# Altium schematic sheet ADF_2nd_LO_board.SchDoc
size A4
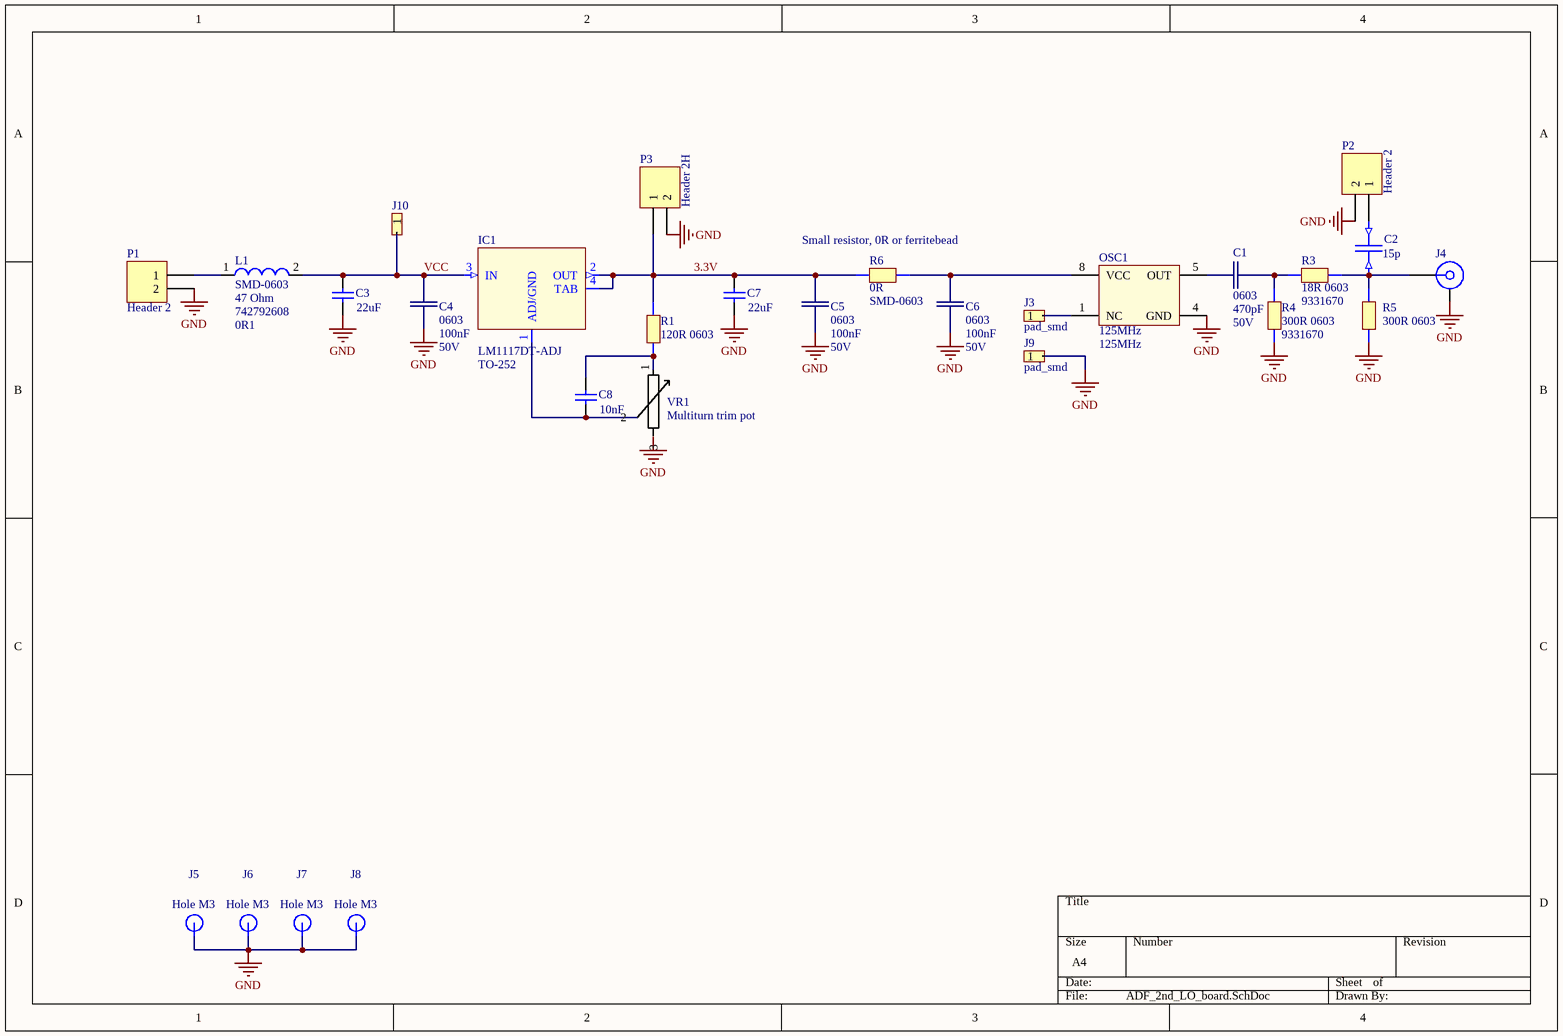
[diagram p0: ADF_2nd_LO_board.SchDoc]

## Parts
C1  Case Code (Imperial): 0603  Capacitance: 470pF  Voltage: 50V  [C0603_murata]  (hidden comment: 10nF 0603 NP0)
C2  value 15p  [CAPC1005X04N_0402]  (hidden comment: Capacitor)
C3  value 22uF  [C1206]  (hidden comment: Cap Semi)
C4  Case Code (Imperial): 0603  Capacitance: 100nF  Voltage: 50V  [C0603_murata]  (hidden comment: 10nF 0603 NP0)
C5  Case Code (Imperial): 0603  Capacitance: 100nF  Voltage: 50V  [C0603_murata]  (hidden comment: 10nF 0603 NP0)
C6  Case Code (Imperial): 0603  Capacitance: 100nF  Voltage: 50V  [C0603_murata]  (hidden comment: 10nF 0603 NP0)
C7  value 22uF  [C1206]  (hidden comment: Cap Semi)
C8  value 10nF  [1608[0603]]  (hidden comment: Cap Semi)
IC1  value LM1117DT-ADJ  [TO-252]  (hidden comment: Voltage Regulator)
J3  pad_smd  [pad_smd_bodge]
J4  32K201-400L5  [ROS-32K201-400L5_V]  (value not drawn)
J5  Hole M3  [HOLE_M3]  (no BOM)
J6  Hole M3  [HOLE_M3]  (no BOM)
J7  Hole M3  [HOLE_M3]  (no BOM)
J8  Hole M3  [HOLE_M3]  (no BOM)
J9  pad_smd  [pad_smd_bodge]
J10  pad_smd  [pad_smd_bodge]  (value not drawn)
L1  Impedance: 47 Ohm  DC_Resistance: 0R1  [SMD-0603]  (hidden comment: 742792608)
OSC1  125MHz  [DIP-8_osc]
P1  Header 2  [HDR1X2]
P2  Header 2  [HDR1X2]
P3  Header 2H  [HDR1X2H]
R1  120R 0603  [R0603]
R3  18R 0603  OrderCode: 9331670  [R0603]
R4  300R 0603  OrderCode: 9331670  [R0603]
R5  300R 0603  [R0603]
R6  value 0R  PackageReference: SMD-0603  [RESC1608X06N_0603]  (hidden comment: Resistor)
VR1  Multiturn trim pot  [Multiturn trimpot flat long]

## Nets
GND: C3.1 C5.2 C6.2 C7.1 J4.MH J5.1 J6.1 J7.1 J8.1 J9.1 OSC1.4(GND) P1.2 P2.2 P3.2 R4.2 R5.1
3.3V: C5.1 C7.2 IC1.2(OUT) IC1.4(TAB) P3.1 R1.1 R6.1
VCC: C3.2 C4.1 IC1.3(IN) J10.1 L1.2
NetC1_1: C1.1 OSC1.5(OUT)
NetC1_2: C1.2 R3.2 R4.1
NetC2_1: C2.1 J4.1 R3.1 R5.2
NetC2_2: C2.2 P2.1
NetC6_1: C6.1 OSC1.8(VCC) R6.2
NetC8_1: C8.1 IC1.1(ADJ/GND) VR1.2
NetC8_2: C8.2 R1.2 VR1.1
NetJ3_1: J3.1 OSC1.1(NC)
NetL1_1: L1.1 P1.1

Not connected (* = marked no-connect by the designer): C4 2; VR1 3

## Notes on the sheet
- (near R6) Small resistor, 0R or ferritebead
- Labels drawn without touching a wire or pin: GND

## Library data of the parts
C1 C4-C6 = 10nF 0603 NP0: 10nF 0603 NP0 muRata; Manufacturer Part Number 1: GRM1885C1H103JA01D; Material: Ceramic; Tolerance: 5%; Dielectric: C0G; Supplier 1: Mouser; Manufacturer 1: Murata; Stock 1: 5; Pricing 1: 1=0.13, 10=0.05, 50=0.05, 100=0.035, 1000=0.024, 10000=0.016 (USD); Case/Package: 0603; Case Code (Metric): 1608; Min Operating Temperature: -55°C; Max Operating Temperature: 125°C; Packaging: Tape and Reel; Package Quantity: 4000; Voltage Rating: 50V; Voltage Rating (DC): 50V; Termination: SMD/SMT; Length: 1.6mm; Height: 0.8mm; Width: 0.8mm; Thickness: 0.035inch; Lead Pitch: 0.5mm; Depth: 0.8mm; REACH SVHC: No SVHC; Lead Free: Lead Free; ComponentLink1URL: https://datasheet.ciiva.com/41860/partnumbering-e-01-41860759.pdf; ComponentLink1Description: https://datasheet.ciiva.com/41860/partnumbering-e-01-41860759.pdf; ComponentLink2URL: https://datasheet.ciiva.com/29537/partnumbering-e-01-29537910.pdf; ComponentLink2Description: https://datasheet.ciiva.com/29537/partnumbering-e-01-29537910.pdf; Supplier Part Number 1: 81-GRM1885C1H103JA1D
C2 = Capacitor_15p_0402_C0G: Class 1 SMD Capacitor; ManufacturerRef: 04025A150JAT2A; Manufacturer: AVX; PowerRating: N.A.; OrderCode: 1327631RL; Seller: Farnell; TemperatureCoeff: 0ppm/°C ± 30ppm/°C; Tolerance: ± 5%; Voltage: 50V; Type: C0G / NP0; PackageDescription: SMD; Published: 15.5.2014; Publisher: atr; PriceEuro: 0.022; PackageReference: SMD-0402
C3 C7 C8 = Cap Semi: Capacitor (Semiconductor SIM Model); Published: 8-Jun-2000; LatestRevisionDate: 29-May-2009; LatestRevisionNote: IPC-7351 Footprint Added.; PackageReference: C1206; Publisher: Altium Limited; PackageDescription: Chip Capacitor
IC1 = LM1117DT-ADJ: TEXAS INSTRUMENTS  LM1117DT-ADJ  V REG ADJ +1.25/13.8V, 1117, DPAK-3; Seller: Farnell; Voltage: 1.25V - 13.8V; OrderCode: 9486267; Type: LM1117DT-ADJ; Manufacturer: TEXAS INSTRUMENTS; ManufacturerRef: LM1117DT-ADJ; PriceEuro: 0.84; PowerRating: -; LatestRevisionDate: 1.9.2014; LatestRevisionNote: Created; PackageDescription: TO-252; Published: 1.9.2014; Publisher: atr; TemperatureCoeff: -; Tolerance: -; PackageReference: TO-252
J3 J9 J10 = pad_smd_1mm*2mm: 1mm * 2mm smd pad
J4 = 32K201-400L5: SMA Right Angle Jack, Up to 18 GHz, -65 to 165 degC; Design Note: Footprint in library is a generic example - only application specific footprint delivers High Performance; DatasheetVersion: a00; PackageVersion: a00; PackageReference: 32K201-400L5; PackageDescription: SMA Right Angle Jack, 14.8 x 6.35 x 9.6 mm; Mounting Technology: Through Hole; PartNumber: 32K201-400L5; ComponentLink1Description: Manufacturer URL; ComponentLink1URL: http://www.rosenberger.de; ComponentLink2Description: Datasheet; ComponentLink2URL: http://rosenberger.de/ok/images/documents/db/32K201-400L5.pdf; ComponentLink3Description: Package Specification; ComponentLink3URL: http://rosenberger.de/ok/images/documents/db/32K201-400L5.pdf; ComponentLink4Description: Series Overview / Design Note; ComponentLink4URL: http://rosenberger.de/ok/images/documents/spez/32.pdf; ComponentLink5Description: Webshop / RFQ; ComponentLink5URL: http://www.rosenberger.com/en/contact/sales/
J5-J8 = HoleM3: PowerRating: N.A.; LatestRevisionDate: 21.5.2014; PackageReference: -; Publisher: atr; PackageDescription: -; Manufacturer: -; ManufacturerRef: -; OrderCode: -; PriceEuro: -; Seller: -; TemperatureCoeff: N.A.; Tolerance: N.A.; Type: Hole; Value: Hole; Voltage: N.A.
L1 = 742792608: SMD EMI Suppression Ferrite Bead WE-CBF, Z = 47 Ohm; Seller: Farnell; OrderCode: 1635681RL; DatasheetVersion: Dec-2005; PackageVersion: 2009; PackageDescription: Chip Inductor, 2-Leads, Body 1.6 x 0.8 mm; ComponentLink1Description: Manufacturer URL; ComponentLink1URL: http://www.we-online.com; ComponentLink2Description: Datasheet; ComponentLink2URL: http://www.we-online.de/katalog/media/pdf/742792608.pdf; PackageReference: SMD-0603; Value: 742792608
OSC1 = OSC DIP-8 125MHz 3.3V TTL: DIP Oscillator; Seller: eBay; Supply VOltage: 3.3VDC; Publisher: ftg; Output: 3.3V TTL; Frequency: 125MHz
P1 P2 = Header 2: Header, 2-Pin; LatestRevisionDate: 17-Jul-2002; LatestRevisionNote: Re-released for DXP Platform.; Publisher: Altium Limited
P3 = Header 2H: Header, 2-Pin, Right Angle; LatestRevisionDate: 17-Jul-2002; LatestRevisionNote: Re-released for DXP Platform.; Publisher: Altium Limited
R1 = 0603 120R: Manufacturer: YAGEO (PHYCOMP); ManufacturerRef: RC0603FR-07120RL; Seller: Farnell; Product Range: MC Series; Resistance: 330; Voltage Rating: 50; Power Rating: 63; Resistance Tolerance: ± 1%; Resistor Element Material: Thick Film; Temperature Coefficient: ± 100; SVHC: No SVHC (17-Dec-2015); External Depth: 0.45; External Length / Height: 1.6; External Width: 0.8; No. of Pins: 2; Reel Quantity: 5000; Resistor Mounting: Surface Mount Device; Temperature Coeff. +: 100; Tolerance +: 1%; Voltage Rating V DC: 50V; Value: 120; Full Power Rating Temperature: 70; Resistor Case Style: 0603; OrderCode: 9238379; RoHS: Y-EX; Pricing 1: 10=0.0129, 100=0.0067, 500=0.0057, 1000=0.005, 2500=0.004, 5000=0.0033, 25000=0.0017, 50000=0.0014 (EUR); Packaging: Cut Tape; MSL: -; Operating Temperature Max: 155; Operating Temperature Min: -55; Operating Temperature Range: -55°C to +155; Tape Width: 8; Temperature Coeff. -: 100; Tolerance -: 1%; ComponentLink1URL: http://www.farnell.com/datasheets/1788326.pdf; ComponentLink1Description: http://www.farnell.com/datasheets/1788326.pdf; ComponentLink2URL: http://www.farnell.com/cad/1561168.zip; ComponentLink2Description: http://www.farnell.com/cad/1561168.zip; Publisher: iv; Stock 1: 50929; ComponentLink3URL: http://www.farnell.com/datasheets/1868787.pdf; ComponentLink3Description: http://www.farnell.com/datasheets/1868787.pdf; ComponentLink4URL: http://www.farnell.com/cad/1555190.zip; ComponentLink4Description: http://www.farnell.com/cad/1555190.zip
R3 R4 = 0603 10R: 10R 0603; Manufacturer: MULTICOMP; ManufacturerRef: MC0063W0603510R; Seller: Farnell; Voltage Rating: 50; Power Rating: 63; Resistance Tolerance: ± 1%; Resistor Element Material: Thick Film; Temperature Coefficient: ± 100; External Depth: 0.45; External Length / Height: 1.6; External Width: 0.8; No. of Pins: 2; Resistor Mounting: Surface Mount Device; Temperature Coeff. +: 100; Tolerance +: 1%; Voltage Rating V DC: 50V; Value: 10; Resistor Case Style: 0603 [1608 Metric]; Product Range: MC Series; Reel Quantity: 5000; RoHS: Y-EX; Packaging: Cut Tape; MSL: -; Operating Temperature Max: 155; Operating Temperature Min: -55; Operating Temperature Range: -55°C to +155; Tape Width: 8; Temperature Coeff. -: 100; Tolerance -: 1%; Publisher: iv; Supplier 1: Farnell; Stock 1: 70916; Pricing 1: 10=0.0099, 100=0.0086, 500=0.0072, 1000=0.0056, 2500=0.0042, 5000=0.0034, 25000=0.0017, 50000=0.0014 (EUR); Resistance: 10; ComponentLink1URL: http://www.farnell.com/datasheets/1788326.pdf; ComponentLink1Description: http://www.farnell.com/datasheets/1788326.pdf
R5 = 0603 10R: 10R 0603; Manufacturer: MULTICOMP; ManufacturerRef: MC0063W0603510R; Seller: Farnell; Voltage Rating: 50; Power Rating: 63; Resistance Tolerance: ± 1%; Resistor Element Material: Thick Film; Temperature Coefficient: ± 100; External Depth: 0.45; External Length / Height: 1.6; External Width: 0.8; No. of Pins: 2; Resistor Mounting: Surface Mount Device; Temperature Coeff. +: 100; Tolerance +: 1%; Voltage Rating V DC: 50V; Value: 10; Resistor Case Style: 0603 [1608 Metric]; Product Range: MC Series; Reel Quantity: 5000; OrderCode: 9331670; RoHS: Y-EX; Packaging: Cut Tape; MSL: -; Operating Temperature Max: 155; Operating Temperature Min: -55; Operating Temperature Range: -55°C to +155; Tape Width: 8; Temperature Coeff. -: 100; Tolerance -: 1%; Publisher: iv; Supplier 1: Farnell; Stock 1: 70916; Pricing 1: 10=0.0099, 100=0.0086, 500=0.0072, 1000=0.0056, 2500=0.0042, 5000=0.0034, 25000=0.0017, 50000=0.0014 (EUR); Resistance: 10; ComponentLink1URL: http://www.farnell.com/datasheets/1788326.pdf; ComponentLink1Description: http://www.farnell.com/datasheets/1788326.pdf
R6 = Resistor_0R_0603_Bulk: Bulk SMD Resistor; Manufacturer: PANASONIC; ManufacturerRef: ERJ3GEY0R00V; Seller: Farnell; Voltage: 75V; PowerRating: 100mW; OrderCode: 2059527RL; TemperatureCoeff: ± 200ppm/°C; Type: Thick Film; PriceEuro: 0.005; PackageDescription: SMD; Published: 15.5.2014; Publisher: atr; Tolerance: -